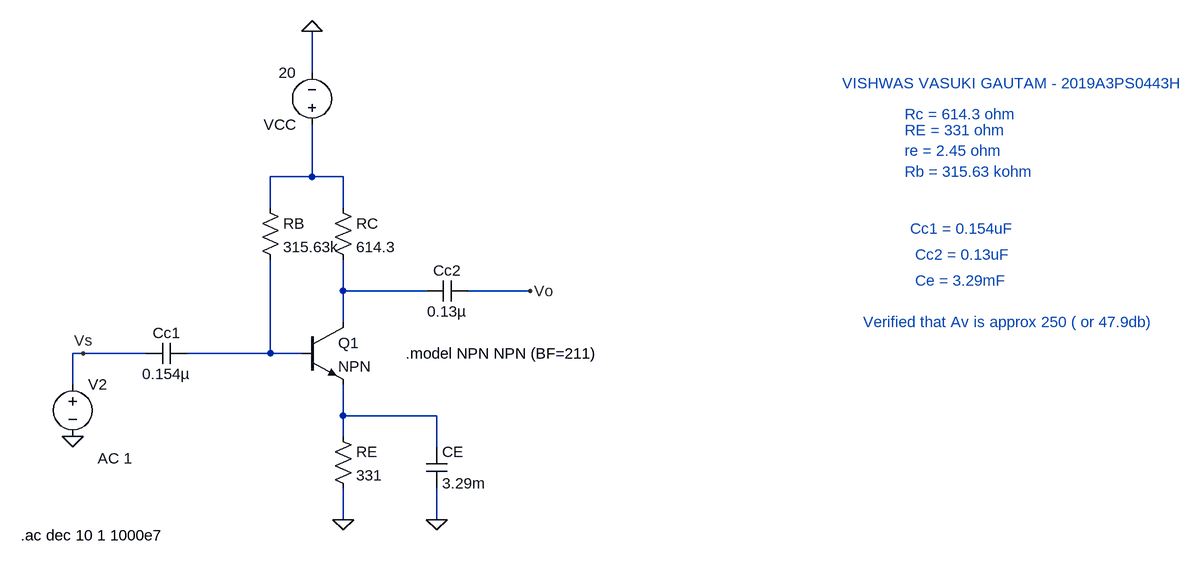
[diagram p0: schematic Compre_Vishwas_2019A3PS0443H.asc]
Compre_Vishwas_2019A3PS0443H.asc, the LTspice schematic file:
Version 4
SHEET 1 880 680
WIRE -976 -720 -976 -784
WIRE -976 -560 -976 -640
WIRE -976 -560 -1040 -560
WIRE -928 -560 -976 -560
WIRE -1040 -512 -1040 -560
WIRE -928 -512 -928 -560
WIRE -928 -384 -928 -432
WIRE -800 -384 -928 -384
WIRE -640 -384 -736 -384
WIRE -928 -336 -928 -384
WIRE -1328 -288 -1344 -288
WIRE -1232 -288 -1328 -288
WIRE -1040 -288 -1040 -432
WIRE -1040 -288 -1168 -288
WIRE -992 -288 -1040 -288
WIRE -1344 -240 -1344 -288
WIRE -928 -192 -928 -240
WIRE -784 -192 -928 -192
WIRE -928 -160 -928 -192
WIRE -784 -144 -784 -192
WIRE -928 -32 -928 -80
WIRE -784 -32 -784 -80
FLAG -1344 -160 0
FLAG -976 -784 0
FLAG -1328 -288 Vs
FLAG -928 -32 0
FLAG -784 -32 0
FLAG -640 -384 Vo
SYMBOL voltage -976 -624 R180
WINDOW 123 0 0 Left 2
WINDOW 39 0 0 Left 2
SYMATTR InstName VCC
SYMATTR Value 20
SYMBOL voltage -1344 -256 R0
WINDOW 123 38 130 Left 2
WINDOW 39 0 0 Left 2
SYMATTR Value2 AC 1
SYMATTR InstName V2
SYMATTR Value ""
SYMBOL cap -1168 -304 R90
WINDOW 0 0 32 VBottom 2
WINDOW 3 32 32 VTop 2
SYMATTR InstName Cc1
SYMATTR Value 0.154µ
SYMBOL res -1056 -528 R0
SYMATTR InstName RB
SYMATTR Value 315.63k
SYMBOL cap -736 -400 R90
WINDOW 0 0 32 VBottom 2
WINDOW 3 32 32 VTop 2
SYMATTR InstName Cc2
SYMATTR Value 0.13µ
SYMBOL res -944 -528 R0
SYMATTR InstName RC
SYMATTR Value 614.3
SYMBOL res -944 -176 R0
SYMATTR InstName RE
SYMATTR Value 331
SYMBOL cap -800 -144 R0
SYMATTR InstName CE
SYMATTR Value 3.29m
SYMBOL npn -992 -336 R0
SYMATTR InstName Q1
TEXT -1424 -8 Left 2 !.ac dec 10 1 1000e7
TEXT -160 -704 Left 2 ;VISHWAS VASUKI GAUTAM - 2019A3PS0443H
TEXT -64 -656 Left 2 ;Rc = 614.3 ohm
TEXT -64 -632 Left 2 ;RE = 331 ohm
TEXT -64 -600 Left 2 ;re = 2.45 ohm
TEXT -64 -568 Left 2 ;Rb = 315.63 kohm
TEXT -832 -288 Left 2 !.model NPN NPN (BF=211)
TEXT -56 -480 Left 2 ;Cc1 = 0.154uF
TEXT -48 -440 Left 2 ;Cc2 = 0.13uF
TEXT -48 -400 Left 2 ;Ce = 3.29mF
TEXT -128 -336 Left 2 ;Verified that Av is approx 250 ( or 47.9db)

The netlist it stands for:
* Compre_Vishwas_2019A3PS0443H.asc
VCC N001 0 20
V2 Vs 0 AC 1
Cc1 N003 Vs 0.154µ
RB N001 N003 315.63k
Cc2 Vo N002 0.13µ
RC N001 N002 614.3
RE N004 0 331
CE N004 0 3.29m
Q1 N002 N003 N004 0 NPN
.model NPN NPN
.model PNP PNP
.lib standard.bjt
.ac dec 10 1 1000e7
* VISHWAS VASUKI GAUTAM - 2019A3PS0443H
* Rc = 614.3 ohm
* RE = 331 ohm
* re = 2.45 ohm
* Rb = 315.63 kohm
.model NPN NPN (BF=211)
* Cc1 = 0.154uF
* Cc2 = 0.13uF
* Ce = 3.29mF
* Verified that Av is approx 250 ( or 47.9db)
.backanno
.end